# Altium schematic sheet wifi_module.SchDoc
size 389 x 250 mm; SheetNumber: 2; SheetTotal: 2
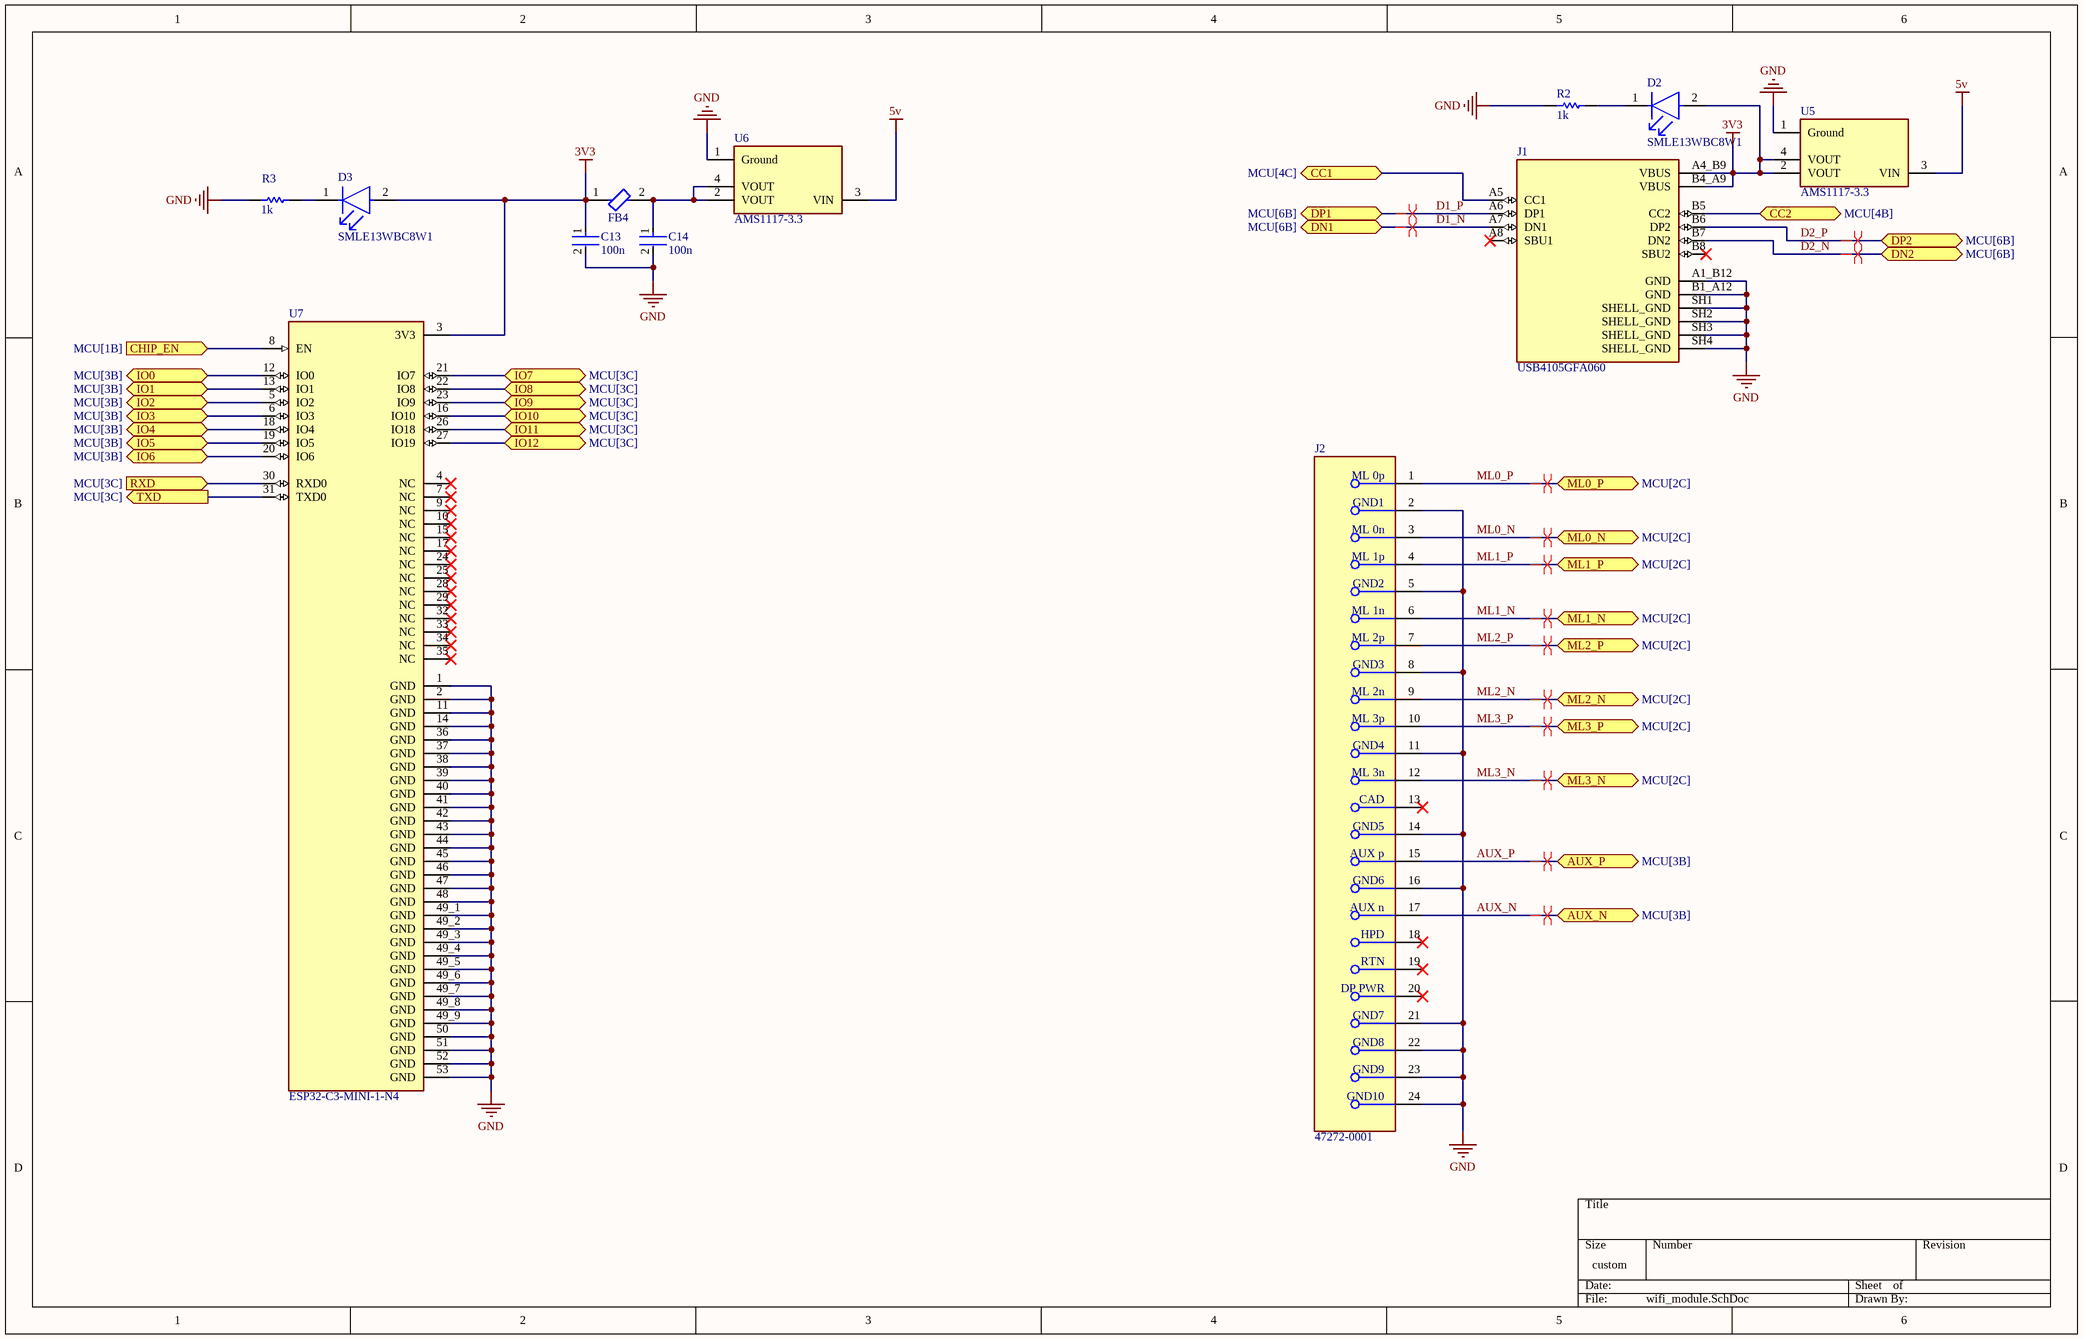
[diagram p0: wifi_module.SchDoc]

## Parts
C13  100n  [FP-CL10-IPC_C]
C14  100n  [FP-CL10-IPC_C]
D2  SMLE13WBC8W1  [FP-SMLE13WBC8W1-MFG]
D3  SMLE13WBC8W1  [FP-SMLE13WBC8W1-MFG]
FB4  BLM18KG121TN1D  [FP-BLM18-0_15-t0_6-d1_2-IPC_A]  (value not drawn)
J1  USB4105GFA060  [GCT_USB4105GFA060]
J2  47272-0001  [FP-47272-0001-MFG]
R2  1k  [RESC2013X60X35ML10T20]
R3  1k  [RESC2013X60X35ML10T20]
U5  AMS1117-3.3  [FP-AMS1117-IPC_C]
U6  AMS1117-3.3  [FP-AMS1117-IPC_C]
U7  ESP32-C3-MINI-1-N4  [XCVR_ESP32-C3-MINI-1-N4]

## Ports
AUX_N (bidir, see MCU[3B]), AUX_P (bidir, see MCU[3B]), CC1 (bidir, see MCU[4C]), CC2 (bidir, see MCU[4B]), CHIP_EN (in, see MCU[1B]), DN1 (bidir, see MCU[6B]), DN2 (bidir, see MCU[6B]), DP1 (bidir, see MCU[6B]), DP2 (bidir, see MCU[6B]), IO0 (bidir, see MCU[3B]), IO1 (bidir, see MCU[3B]), IO2 (bidir, see MCU[3B]), IO3 (bidir, see MCU[3B]), IO4 (bidir, see MCU[3B]), IO5 (bidir, see MCU[3B]), IO6 (bidir, see MCU[3B]), IO7 (bidir, see MCU[3C]), IO8 (bidir, see MCU[3C]), IO9 (bidir, see MCU[3C]), IO10 (bidir, see MCU[3C]), IO11 (bidir, see MCU[3C]), IO12 (bidir, see MCU[3C]), ML0_N (bidir, see MCU[2C]), ML0_P (bidir, see MCU[2C]), ML1_N (bidir, see MCU[2C]), ML1_P (bidir, see MCU[2C]), ML2_N (bidir, see MCU[2C]), ML2_P (bidir, see MCU[2C]), ML3_N (bidir, see MCU[2C]), ML3_P (bidir, see MCU[2C]), RXD (in, see MCU[3C]), TXD (out, see MCU[3C])

## Nets
3V3: C13.1 D2.2(A) D3.2(A) FB4.1 J1.A4_B9(VBUS) J1.B4_A9(VBUS) U5.2(VOUT) U5.4(VOUT) U7.3(3V3)
5v: U5.3(VIN) U6.3(VIN)
GND: C13.2 C14.2 J1.A1_B12(GND) J1.B1_A12(GND) J1.SH1(SHELL_GND) J1.SH2(SHELL_GND) J1.SH3(SHELL_GND) J1.SH4(SHELL_GND) J2.2(GND1) J2.5(GND2) J2.8(GND3) J2.11(GND4) J2.14(GND5) J2.16(GND6) J2.21(GND7) J2.22(GND8) J2.23(GND9) J2.24(GND10) R2.1 R3.1 U5.1(Ground) U6.1(Ground) U7.1(GND) U7.2(GND) U7.11(GND) U7.14(GND) U7.36(GND) U7.37(GND) U7.38(GND) U7.39(GND) U7.40(GND) U7.41(GND) U7.42(GND) U7.43(GND) U7.44(GND) U7.45(GND) U7.46(GND) U7.47(GND) U7.48(GND) U7.49_1(GND) U7.49_2(GND) U7.49_3(GND) U7.49_4(GND) U7.49_5(GND) U7.49_6(GND) U7.49_7(GND) U7.49_8(GND) U7.49_9(GND) U7.50(GND) U7.51(GND) U7.52(GND) U7.53(GND)
AUX_N: J2.17(AUX_n) ; port AUX_N
AUX_P: J2.15(AUX_p) ; port AUX_P
CC1: J1.A5(CC1) ; port CC1
CC2: J1.B5(CC2) ; port CC2
CHIP_EN: U7.8(EN) ; port CHIP_EN
D1_N: J1.A7(DN1) ; port DN1
D1_P: J1.A6(DP1) ; port DP1
D2_N: J1.B7(DN2) ; port DN2
D2_P: J1.B6(DP2) ; port DP2
IO0: U7.12(IO0) ; port IO0
IO1: U7.13(IO1) ; port IO1
IO2: U7.5(IO2) ; port IO2
IO3: U7.6(IO3) ; port IO3
IO4: U7.18(IO4) ; port IO4
IO5: U7.19(IO5) ; port IO5
IO6: U7.20(IO6) ; port IO6
IO7: U7.21(IO7) ; port IO7
IO8: U7.22(IO8) ; port IO8
IO9: U7.23(IO9) ; port IO9
IO10: U7.16(IO10) ; port IO10
IO11: U7.26(IO18) ; port IO11
IO12: U7.27(IO19) ; port IO12
ML0_N: J2.3(ML_0n) ; port ML0_N
ML0_P: J2.1(ML_0p) ; port ML0_P
ML1_N: J2.6(ML_1n) ; port ML1_N
ML1_P: J2.4(ML_1p) ; port ML1_P
ML2_N: J2.9(ML_2n) ; port ML2_N
ML2_P: J2.7(ML_2p) ; port ML2_P
ML3_N: J2.12(ML_3n) ; port ML3_N
ML3_P: J2.10(ML_3p) ; port ML3_P
RXD: U7.30(RXD0) ; port RXD
TXD: U7.31(TXD0) ; port TXD
NetC14_1: C14.1 FB4.2 U6.2(VOUT) U6.4(VOUT)
NetD2_1: D2.1(C) R2.2
NetD3_1: D3.1(C) R3.2

Not connected (* = marked no-connect by the designer): J1 A8(SBU1)* B8(SBU2)*; J2 13(CAD)* 18(HPD)* 19(RTN)* 20(DP_PWR)*; U7 4(NC)* 7(NC)* 9(NC)* 10(NC)* 15(NC)* 17(NC)* 24(NC)* 25(NC)* 28(NC)* 29(NC)* 32(NC)* 33(NC)* 34(NC)* 35(NC)*

## Layout directives
differential pair: AUX_N, AUX_P, D1_N, D1_P, D2_N, D2_P, ML0_N, ML0_P, ML1_N, ML1_P, ML2_N, ML2_P, ML3_N, ML3_P

## Library data of the parts
C13 C14 = CMP-13271-003017-1: Cap Ceramic 4.7uF 10V X5R ±10% Pad SMD 0603 +85°C T/R; Capacitance: 4.7uF; Case/Package: 0603; Packaging: Tape and Reel; Width: 0.031inch; Contact Plating: Tin; Thickness: 0.035inch; Package Quantity: 1; Voltage Rating: 10V; Case Code (Metric): 1608; Case Code (Imperial): 0603; Depth: 0.8mm; Height: 0.8mm; Tolerance: 10%; Max Operating Temperature: 85°C; Length: 1.6mm; Dielectric: X5R; Mount: Surface Mount; Radiation Hardening: No; Min Operating Temperature: -55°C
D2 D3 = CMP-08952-000004-1: LED WHITE 0603 SMD; Manufacturer: Rohm; Luminous Intensity: 140mcd; Led Orientation: Top View; Reverse Voltage: 5V; Forward Voltage: 2.9V; Forward Current: 5mA; Power Dissipation: 66mW; Temperature Range Low: -40°C; Digikey Description: LED WHITE 0603 SMD; Temperature Range High: +85°C; Temperature: -40°C to +85°C; Manufacturer Part Number: SMLE13WBC8W1; Colour: White; Mouser Description: Standard LEDs - SMD ExceLED White LED 120mcd 5mA; Octopart: https://octopart.com/smle13wbc8w1-rohm-22224565; Automotive: No; Device Class L2: LEDs; Lead Free: Yes; ComponentLink2URL: https://media.digikey.com/pdf/Data%20Sheets/Rohm%20PDFs/SMLE13WBC8W1_Spec.pdf; Device Class L3: unset; Package: 0; RoHS: TRUE; Height: 0.4mm; Category: Diode; Device Class L1: Optoelectronics; ComponentLink2Description: Datasheet
FB4 = CMP-0686-00554-8: FERRITE BEAD 120 OHM 0603 1LN; Max Current Rating: 3A; DC Resistance (DCR): 30mR; Impedance: 120R; Number of Lines: 1; Test Frequency: 100MHz; Tolerance: 25%; Package Quantity: 4000; Min Operating Temperature: -55°C; Termination: SMD/SMT; REACH SVHC: No SVHC; Core Material: Ferrite; Material: Ferrite; Current Rating: 3A; Height: 0.8mm; Number of Pins: 2; Case/Package: 0603; Case Code (Imperial): 0603; Series: BLM18K; Packaging: Tape and Reel; Inductor Type: FERRITE BEAD; Lead Free: Lead Free; Width: 0.8mm; Case Code (Metric): 1608; Number of Circuits: 1; Max DC Current: 3A; Depth: 0.95mm; Max Operating Temperature: 125°C; Length: 1.6mm; RoHS Compliant: Yes
J1 = USB4105GFA060: MF: {'manufacturer': u'GCT'}; Package: None; Price: None; Value: *; MP: USB4105GFA060; Availability: Unavailable
J2 = CMP-2000-05608-2: CONN RCPT DISPLAYPORT 20P SMD RA; Manufacturer: Molex; Voltage Rating: 40V; Is Female: yes; Shielding: true; Number Of Contacts: 20; Conn Orientation: Right Angle; Current Rating: 0.5A; Pitch: 0.5mm; Device Class L2: Audio / Video Connectors; Temperature: -20°C to +85°C; Contact Material: Gold,Nickel; Footprint Url: https://www.molex.com/pdm_docs/sd/472720001_sd.pdf; Device Class L1: Connectors; ComponentLink2Description: Datasheet; Temperature Range Low: -20°C; Automotive: No; Package: 0; Height: 6.9mm; RoHS: TRUE; Octopart: https://octopart.com/47272-0001-molex-5441289; Lead Free: Yes; ComponentLink2URL: https://www.molex.com/webdocs/datasheets/pdf/en-us/0472720001_IO_CONNECTORS.pdf; Device Class L3: unset; Mouser Description: HDMI, Displayport & DVI Connectors .5MM RA SMT RCPT; Category: Conn; Manufacturer Part Number: 47272-0001; Digikey Description: CONN RCPT DISPLAYPORT 20P SMD RA; Temperature Range High: +85°C
R2 R3 = CMP-2100-03673-1: Chip Resistor, 0 Ohm, Jumper, +/- 5%, 0.125 W, -55 to 155 degC, 0805 (2012 Metric), RoHS, Tape and Reel; Manufacturer: Yageo; Power Rating: 125mW; Resistance: 0mOhm; Voltage Rating (DC): 150V; Temperature Coefficient: 200ppm/degreesC; Height: 0.5mm; Depth: 1.25mm; Case Code (Imperial): 0805; Lead Free: LeadFree; Military Standard: Not; Package Description: 2-Pin Surface Mounted Device, Body 2 x 1.25 mm; Case Code (Metric): 2012; Composition: ThickFilm; Voltage Rating: 150V; Manufacturer URL: http://www.yageo.com/; Packaging: TapeandReel; Package Reference: 0805; REACH SVHC: Unknown; Tolerance: 5%; Case/Package: 0805; Max Operating Temperature: 155degC; Number of Pins: 2; Min Operating Temperature: -55degC; RoHSCompliant: true; Length: 2mm; Datasheet URL: http://www.yageo.com/NewPortal/yageodocoutput?fileName=/pdf/R-Chip/PYu-RC_Group_51_RoHS_L_5.pdf; Termination: SMD/SMT; Radiation Hardening: No; Width: 1.25mm; Contact Plating: Tin; Datasheet Version: Rev. 5, 10/2016
U5 U6 = CMP-209535-000001-1: LDO Voltage Regulators 1A, 3.3V; Manufacturer: Advanced Monolithic Systems; Dropout Voltage: 1.1V; Output Type: Fixed; Nominal Supply Current: 5mA; Max Power Dissipation: 1.2W; Max Supply Voltage: 15V; Number Of Outputs: 1; Standoff Height: 0.64mm; Max Junction Temp: +125°C; Height: 1.8mm; Package: AMS1117; Device Class L2: Power Management ICs; ComponentLink2Description: Datasheet; ComponentLink2URL: http://www.advanced-monolithic.com/pdf/ds1117.pdf; Category: IC; RoHS: TRUE; Automotive: No; Device Class L1: Integrated Circuits (ICs); Output Current: 1A; Device Class L3: Voltage Regulators - Linear; Temperature: -40°C to +125°C; Output Voltage: 3.3V; Manufacturer Part Number: AMS1117-3.3; Temperature Range Low: -40°C; Octopart: https://octopart.com/ams1117-3.3-advanced+monolithic+systems-25899300; Lead Free: Yes; Ipc Land Pattern Name: SOT229P700X180-4; Temperature Range High: +125°C
U7 = ESP32-C3-MINI-1-N4: Bluetooth, WiFi 802.11b/g/n, Bluetooth v5.0 Transceiver Module 2.412GHz ~ 2.484GHz PCB Trace Surface Mount; MF: Espressif Systems; SnapEDA_Link: https://www.snapeda.com/parts/ESP32-C3-MINI-1-N4/Espressif+Systems/view-part/?ref=snap; Package: SMD-53 Espressif Systems; Value: *; MP: ESP32-C3-MINI-1-N4; Check_prices: https://www.snapeda.com/parts/ESP32-C3-MINI-1-N4/Espressif+Systems/view-part/?ref=eda